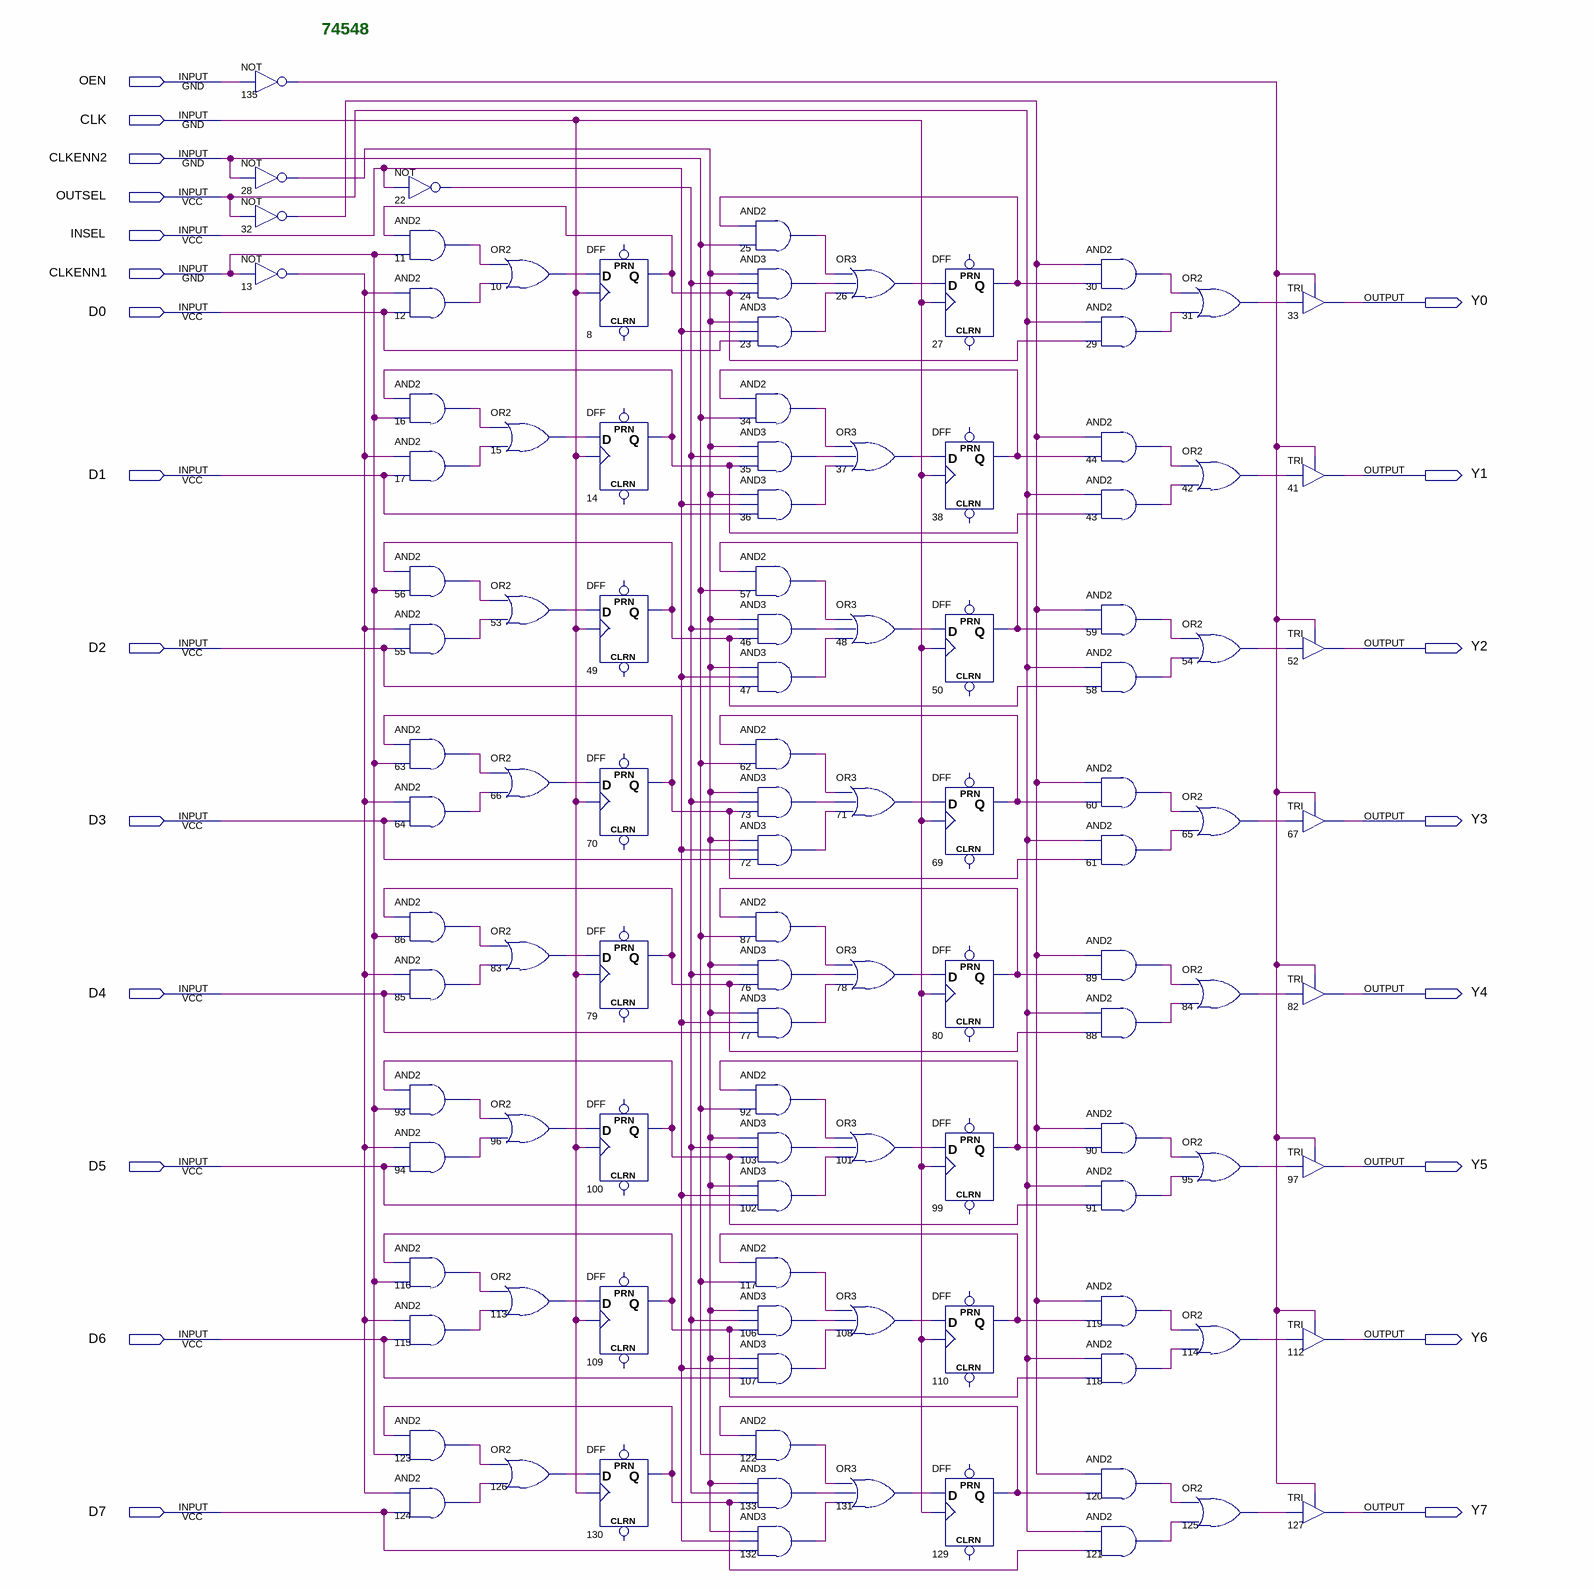
[diagram p0: schematic sheet]
// Quartus schematic 74548.bdf as structural Verilog: 109 symbols, 22 pins
module \74548  (
  input  OEN,
  input  CLK,
  input  CLKENN2,
  input  OUTSEL,
  input  INSEL,
  input  CLKENN1,
  input  D0,
  input  D1,
  input  D2,
  input  D3,
  input  D4,
  input  D5,
  input  D6,
  input  D7,
  output Y0,
  output Y1,
  output Y2,
  output Y3,
  output Y4,
  output Y5,
  output Y6,
  output Y7
);

  wire n8_q, n10_out, n11_out, n12_out, n13_out, n14_q, n15_out, n16_out, n17_out, n22_out, n23_out, n24_out,
       n25_out, n26_out, n27_q, n28_out, n29_out, n30_out, n31_out, n32_out, n34_out, n35_out, n36_out,
       n37_out, n38_q, n42_out, n43_out, n44_out, n46_out, n47_out, n48_out, n49_q, n50_q, n53_out, n54_out,
       n55_out, n56_out, n57_out, n58_out, n59_out, n60_out, n61_out, n62_out, n63_out, n64_out, n65_out,
       n66_out, n69_q, n70_q, n71_out, n72_out, n73_out, n76_out, n77_out, n78_out, n79_q, n80_q, n83_out,
       n84_out, n85_out, n86_out, n87_out, n88_out, n89_out, n90_out, n91_out, n92_out, n93_out, n94_out,
       n95_out, n96_out, n99_q, n100_q, n101_out, n102_out, n103_out, n106_out, n107_out, n108_out, n109_q,
       n110_q, n113_out, n114_out, n115_out, n116_out, n117_out, n118_out, n119_out, n120_out, n121_out,
       n122_out, n123_out, n124_out, n125_out, n126_out, n129_q, n130_q, n131_out, n132_out, n133_out,
       n135_out;

  not u_135 (n135_out, OEN);
  not u_28 (n28_out, CLKENN2);
  not u_32 (n32_out, OUTSEL);
  not u_13 (n13_out, CLKENN1);
  not u_22 (n22_out, INSEL);
  and u_11 (n11_out, n8_q, CLKENN1);
  and u_12 (n12_out, n13_out, D0);
  and u_16 (n16_out, n14_q, CLKENN1);
  and u_17 (n17_out, n13_out, D1);
  and u_56 (n56_out, n49_q, CLKENN1);
  and u_55 (n55_out, n13_out, D2);
  and u_63 (n63_out, n70_q, CLKENN1);
  and u_64 (n64_out, n13_out, D3);
  and u_86 (n86_out, n79_q, CLKENN1);
  and u_85 (n85_out, n13_out, D4);
  and u_93 (n93_out, n100_q, CLKENN1);
  and u_94 (n94_out, n13_out, D5);
  and u_116 (n116_out, n109_q, CLKENN1);
  and u_115 (n115_out, n13_out, D6);
  and u_123 (n123_out, n130_q, CLKENN1);
  and u_124 (n124_out, n13_out, D7);
  or u_10 (n10_out, n11_out, n12_out);
  or u_15 (n15_out, n16_out, n17_out);
  or u_53 (n53_out, n56_out, n55_out);
  or u_66 (n66_out, n63_out, n64_out);
  or u_83 (n83_out, n86_out, n85_out);
  or u_96 (n96_out, n93_out, n94_out);
  or u_113 (n113_out, n116_out, n115_out);
  or u_126 (n126_out, n123_out, n124_out);
  DFF u_8 (.CLK(CLK), .D(n10_out), .Q(n8_q));  // open: CLRN, PRN
  DFF u_14 (.CLK(CLK), .D(n15_out), .Q(n14_q));  // open: CLRN, PRN
  DFF u_49 (.CLK(CLK), .D(n53_out), .Q(n49_q));  // open: CLRN, PRN
  DFF u_70 (.CLK(CLK), .D(n66_out), .Q(n70_q));  // open: CLRN, PRN
  DFF u_79 (.CLK(CLK), .D(n83_out), .Q(n79_q));  // open: CLRN, PRN
  DFF u_100 (.CLK(CLK), .D(n96_out), .Q(n100_q));  // open: CLRN, PRN
  DFF u_109 (.CLK(CLK), .D(n113_out), .Q(n109_q));  // open: CLRN, PRN
  DFF u_130 (.CLK(CLK), .D(n126_out), .Q(n130_q));  // open: CLRN, PRN
  and u_25 (n25_out, n27_q, CLKENN2);
  and u_24 (n24_out, n28_out, n22_out, n8_q);
  and u_23 (n23_out, n28_out, INSEL, D0);
  and u_34 (n34_out, n38_q, CLKENN2);
  and u_35 (n35_out, n28_out, n22_out, n14_q);
  and u_36 (n36_out, n28_out, INSEL, D1);
  and u_57 (n57_out, n50_q, CLKENN2);
  and u_46 (n46_out, n28_out, n22_out, n49_q);
  and u_47 (n47_out, n28_out, INSEL, D2);
  and u_62 (n62_out, n69_q, CLKENN2);
  and u_73 (n73_out, n28_out, n22_out, n70_q);
  and u_72 (n72_out, n28_out, INSEL, D3);
  and u_87 (n87_out, n80_q, CLKENN2);
  and u_76 (n76_out, n28_out, n22_out, n79_q);
  and u_77 (n77_out, n28_out, INSEL, D4);
  and u_92 (n92_out, n99_q, CLKENN2);
  and u_103 (n103_out, n28_out, n22_out, n100_q);
  and u_102 (n102_out, n28_out, INSEL, D5);
  and u_117 (n117_out, n110_q, CLKENN2);
  and u_106 (n106_out, n28_out, n22_out, n109_q);
  and u_107 (n107_out, n28_out, INSEL, D6);
  and u_122 (n122_out, n129_q, CLKENN2);
  and u_133 (n133_out, n28_out, n22_out, n130_q);
  and u_132 (n132_out, n28_out, INSEL, D7);
  or u_26 (n26_out, n25_out, n24_out, n23_out);
  or u_37 (n37_out, n34_out, n35_out, n36_out);
  or u_48 (n48_out, n57_out, n46_out, n47_out);
  or u_71 (n71_out, n62_out, n73_out, n72_out);
  or u_78 (n78_out, n87_out, n76_out, n77_out);
  or u_101 (n101_out, n92_out, n103_out, n102_out);
  or u_108 (n108_out, n117_out, n106_out, n107_out);
  or u_131 (n131_out, n122_out, n133_out, n132_out);
  DFF u_27 (.CLK(CLK), .D(n26_out), .Q(n27_q));  // open: CLRN, PRN
  DFF u_38 (.CLK(CLK), .D(n37_out), .Q(n38_q));  // open: CLRN, PRN
  DFF u_50 (.CLK(CLK), .D(n48_out), .Q(n50_q));  // open: CLRN, PRN
  DFF u_69 (.CLK(CLK), .D(n71_out), .Q(n69_q));  // open: CLRN, PRN
  DFF u_80 (.CLK(CLK), .D(n78_out), .Q(n80_q));  // open: CLRN, PRN
  DFF u_99 (.CLK(CLK), .D(n101_out), .Q(n99_q));  // open: CLRN, PRN
  DFF u_110 (.CLK(CLK), .D(n108_out), .Q(n110_q));  // open: CLRN, PRN
  DFF u_129 (.CLK(CLK), .D(n131_out), .Q(n129_q));  // open: CLRN, PRN
  and u_30 (n30_out, n32_out, n27_q);
  and u_29 (n29_out, OUTSEL, n8_q);
  and u_44 (n44_out, n32_out, n38_q);
  and u_43 (n43_out, OUTSEL, n14_q);
  and u_59 (n59_out, n32_out, n50_q);
  and u_58 (n58_out, OUTSEL, n49_q);
  and u_60 (n60_out, n32_out, n69_q);
  and u_61 (n61_out, OUTSEL, n70_q);
  and u_89 (n89_out, n32_out, n80_q);
  and u_88 (n88_out, OUTSEL, n79_q);
  and u_90 (n90_out, n32_out, n99_q);
  and u_91 (n91_out, OUTSEL, n100_q);
  and u_119 (n119_out, n32_out, n110_q);
  and u_118 (n118_out, OUTSEL, n109_q);
  and u_120 (n120_out, n32_out, n129_q);
  and u_121 (n121_out, OUTSEL, n130_q);
  or u_31 (n31_out, n30_out, n29_out);
  or u_42 (n42_out, n44_out, n43_out);
  or u_54 (n54_out, n59_out, n58_out);
  or u_65 (n65_out, n60_out, n61_out);
  or u_84 (n84_out, n89_out, n88_out);
  or u_95 (n95_out, n90_out, n91_out);
  or u_114 (n114_out, n119_out, n118_out);
  or u_125 (n125_out, n120_out, n121_out);
  TRI u_33 (.IN(n31_out), .OE(n135_out), .OUT(Y0));
  TRI u_41 (.IN(n42_out), .OE(n135_out), .OUT(Y1));
  TRI u_52 (.IN(n54_out), .OE(n135_out), .OUT(Y2));
  TRI u_67 (.IN(n65_out), .OE(n135_out), .OUT(Y3));
  TRI u_82 (.IN(n84_out), .OE(n135_out), .OUT(Y4));
  TRI u_97 (.IN(n95_out), .OE(n135_out), .OUT(Y5));
  TRI u_112 (.IN(n114_out), .OE(n135_out), .OUT(Y6));
  TRI u_127 (.IN(n125_out), .OE(n135_out), .OUT(Y7));

  // Notes on the sheet:
  //   74548
endmodule
